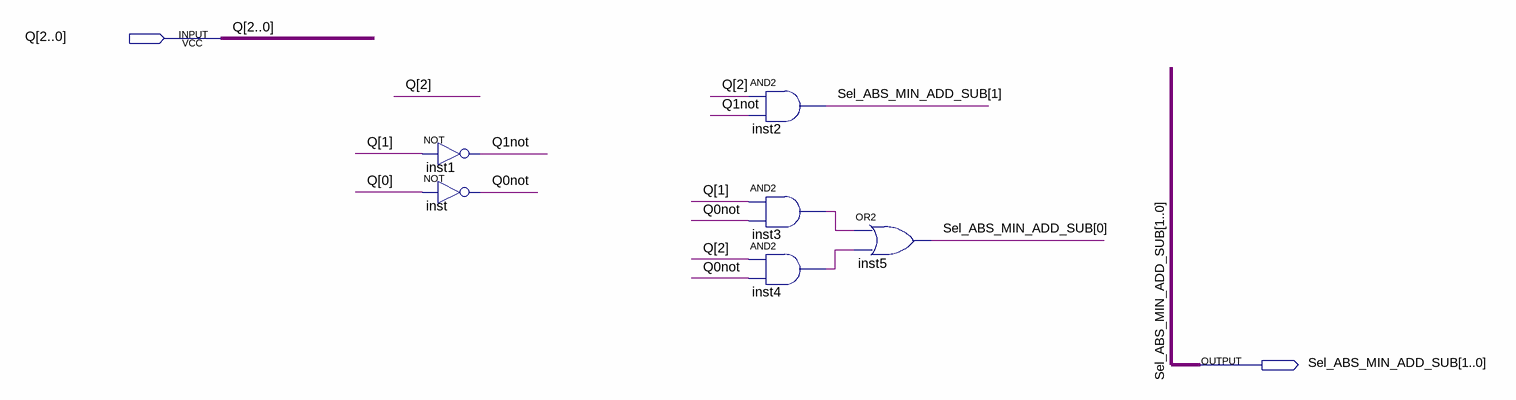
[diagram p0: schematic sheet]
// Quartus schematic Ctrl_ABS_MIN_ADD_SUB.bdf as structural Verilog: 6 symbols, 2 pins
module Ctrl_ABS_MIN_ADD_SUB (
  input  [2:0] Q,
  output [1:0] Sel_ABS_MIN_ADD_SUB
);

  wire inst3_out, inst4_out, Q0not, Q1not;

  not inst1 (Q1not, Q[1]);
  not inst (Q0not, Q[0]);
  and inst2 (Sel_ABS_MIN_ADD_SUB[1], Q[2], Q1not);
  and inst3 (inst3_out, Q[1], Q0not);
  and inst4 (inst4_out, Q[2], Q0not);
  or inst5 (Sel_ABS_MIN_ADD_SUB[0], inst3_out, inst4_out);
endmodule
